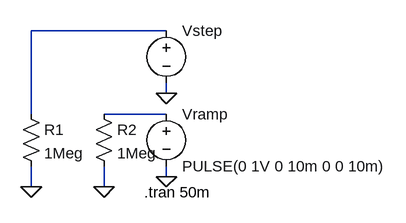
[diagram p0: schematic CurveTracer.asc]
CurveTracer.asc, the LTspice schematic file:
Version 4
SHEET 1 976 680
WIRE 0 112 -208 112
WIRE 0 208 0 192
WIRE -208 240 -208 112
WIRE 0 240 -96 240
WIRE 0 336 0 320
WIRE -208 352 -208 320
WIRE -96 352 -96 320
FLAG 0 208 0
FLAG 0 336 0
FLAG -208 352 0
FLAG -96 352 0
SYMBOL voltage 0 96 R0
WINDOW 3 24 96 Invisible 2
WINDOW 123 0 0 Left 0
WINDOW 39 0 0 Left 0
SYMATTR InstName Vstep
SYMATTR Value PWL(0m 0 9.9m 0 10m 0.1 19.9m 0.1 20m 0.2 29.9m 0.2 30m .3 39.9m 0.3 40m .4 49.9m .4 50m .5 59.9m .5)
SYMBOL voltage 0 224 R0
WINDOW 123 0 0 Left 0
WINDOW 39 0 0 Left 0
SYMATTR InstName Vramp
SYMATTR Value PULSE(0 1V 0 10m 0 0 10m)
SYMBOL res -224 224 R0
SYMATTR InstName R1
SYMATTR Value 1Meg
SYMBOL res -112 224 R0
SYMATTR InstName R2
SYMATTR Value 1Meg
TEXT -34 360 Left 2 !.tran 50m

The netlist it stands for:
* CurveTracer.asc
Vstep N001 0 PWL(0m 0 9.9m 0 10m 0.1 19.9m 0.1 20m 0.2 29.9m 0.2 30m .3 39.9m 0.3 40m .4 49.9m .4 50m .5 59.9m .5)
Vramp N002 0 PULSE(0 1V 0 10m 0 0 10m)
R1 N001 0 1Meg
R2 N002 0 1Meg
.tran 50m
.backanno
.end